# Altium schematic sheet Microcontroller.SchDoc
size Legal
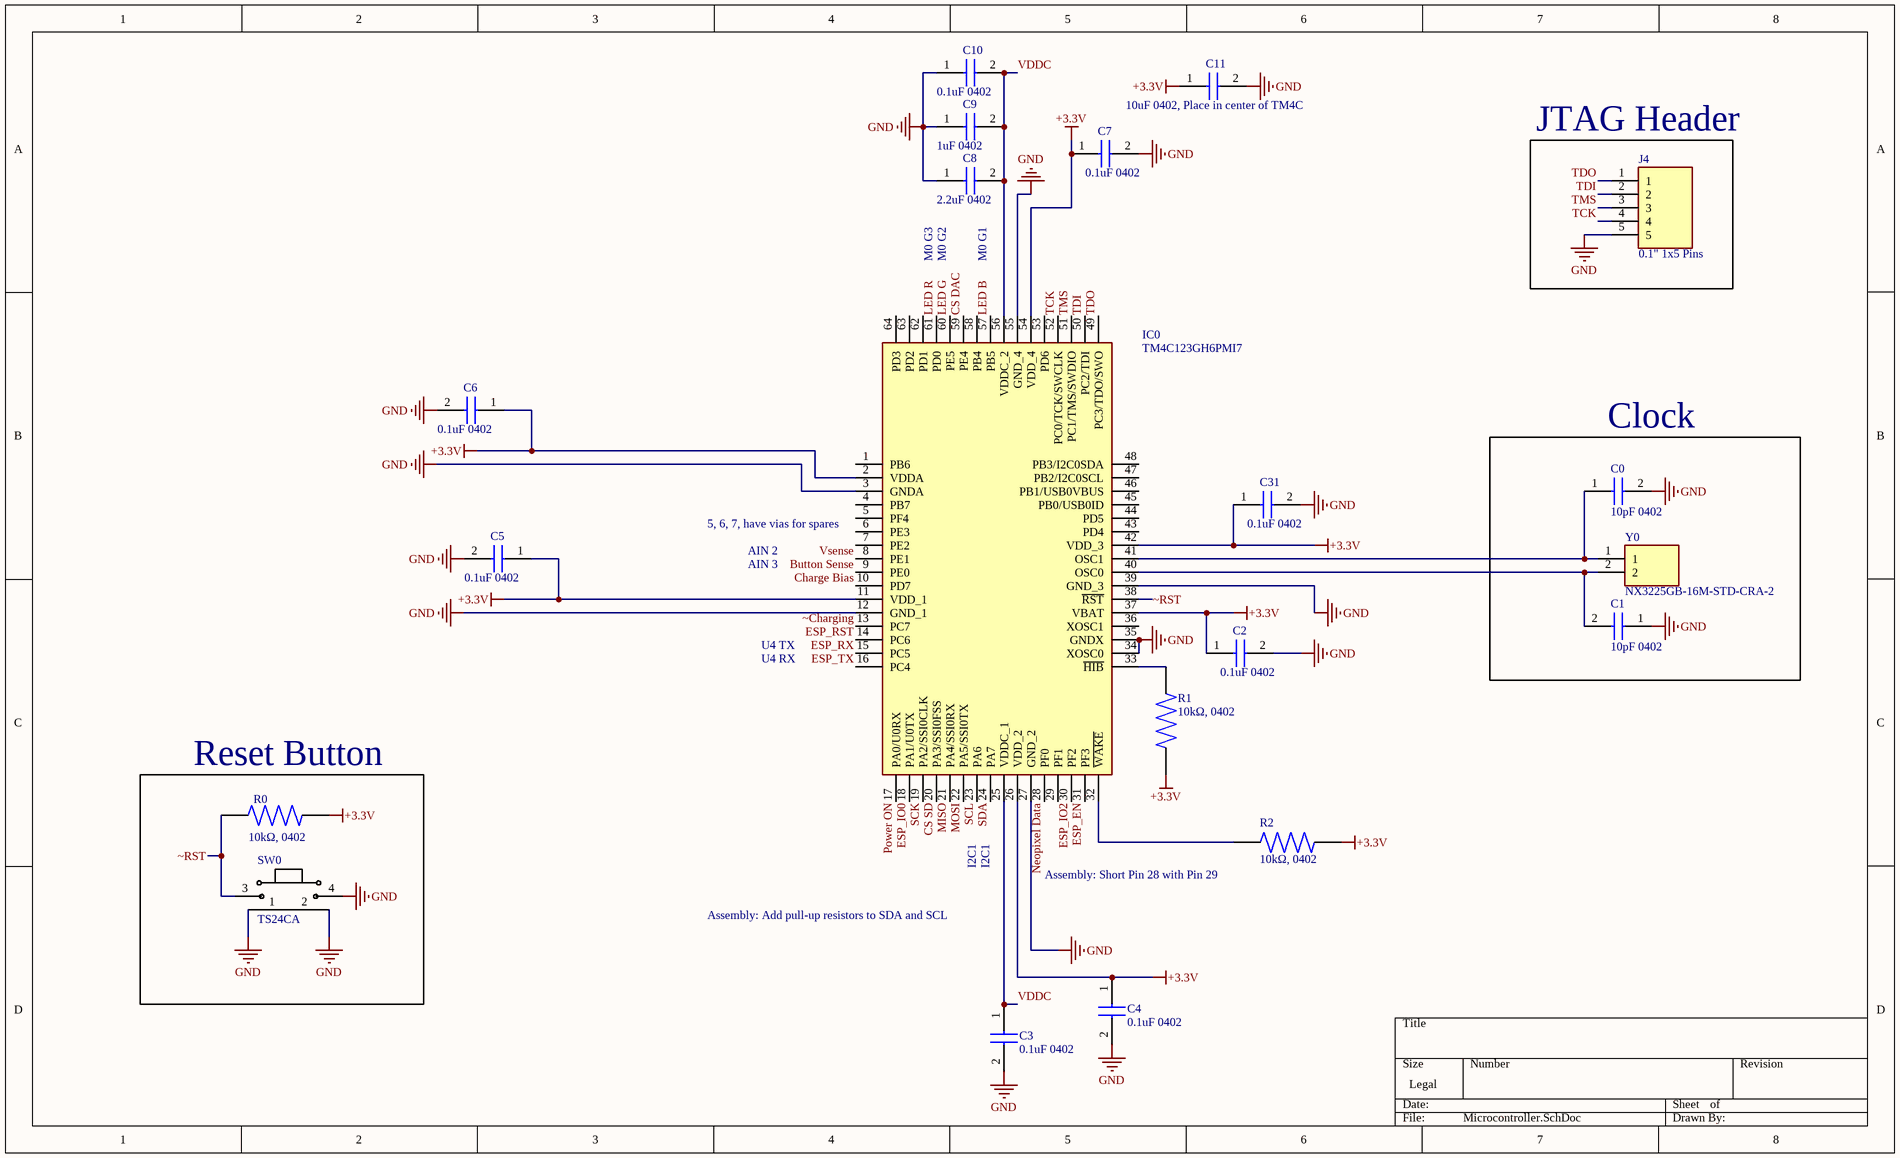
[diagram p0: Microcontroller.SchDoc]

## Parts
C0  10pF 0402  [CAPC1005X56N]
C1  10pF 0402  [CAPC1005X56N]
C2  0.1uF 0402  [CAPC1005X56N]
C3  0.1uF 0402  [CAPC1005X56N]
C4  0.1uF 0402  [CAPC1005X56N]
C5  0.1uF 0402  [CAPC1005X56N]
C6  0.1uF 0402  [CAPC1005X56N]
C7  0.1uF 0402  [CAPC1005X56N]
C8  2.2uF 0402  [CAPC1005X56N]
C9  1uF 0402  [CAPC1005X56N]
C10  0.1uF 0402  [CAPC1005X56N]
C11  10uF 0402, Place in center of TM4C  [CAPC1005X56N]
C31  0.1uF 0402  [CAPC1005X56N]
IC0  TM4C123GH6PMI7  [QFP50P1200X1200X160-64N]
J4  0.1" 1x5 Pins  [HDRV5W64P0X254_1X5_1270X254X610P]
R0  10kΩ, 0402  [0402]
R1  10kΩ, 0402  [0402]
R2  10kΩ, 0402  [0402]
SW0  TS24CA  [TS24CA]
Y0  NX3225GB-16M-STD-CRA-2  [NX3225GD-STD-CRA-3]

## Blocks framed on the sheet
JTAG Header: J4
Clock: C0 C1 Y0
Reset Button: R0 SW0

## Nets
+3.3V: C2.1 C4.1 C5.1 C6.1 C7.1 C11.1 C31.1 IC0.2(VDDA) IC0.11(VDD_1) IC0.26(VDD_2) IC0.37(VBAT) IC0.42(VDD_3) IC0.54(VDD_4) R0.2 R1.2 R2.2
GND: C0.2 C1.1 C2.2 C3.2 C4.2 C5.2 C6.2 C7.2 C8.1 C9.1 C10.1 C11.2 C31.2 IC0.3(GNDA) IC0.12(GND_1) IC0.27(GND_2) IC0.34(XOSC0) IC0.35(GNDX) IC0.39(GND_3) IC0.55(GND_4) J4.5 SW0.1 SW0.2 SW0.4
Button Sense: IC0.9(PE0)
Charge Bias: IC0.10(PD7)
CS DAC: IC0.59(PE4)
CS SD: IC0.20(PA3/SSI0FSS)
ESP_EN: IC0.31(PF3)
ESP_IO0: IC0.18(PA1/U0TX)
ESP_IO2: IC0.30(PF2)
ESP_RST: IC0.14(PC6)
ESP_RX: IC0.15(PC5)
ESP_TX: IC0.16(PC4)
LED B: IC0.57(PB5)
LED G: IC0.60(PE5)
LED R: IC0.61(PD0)
MISO: IC0.21(PA4/SSI0RX)
MOSI: IC0.22(PA5/SSI0TX)
Neopixel Data: IC0.28(PF0)
Power ON: IC0.17(PA0/U0RX)
SCK: IC0.19(PA2/SSI0CLK)
SCL: IC0.23(PA6)
SDA: IC0.24(PA7)
TCK: IC0.52(PC0/TCK/SWCLK) J4.4
TDI: IC0.50(PC2/TDI) J4.2
TDO: IC0.49(PC3/TDO/SWO) J4.1
TMS: IC0.51(PC1/TMS/SWDIO) J4.3
VDDC: C3.1 C8.2 C9.2 C10.2 IC0.25(VDDC_1) IC0.56(VDDC_2)
Vsense: IC0.8(PE1)
~Charging: IC0.13(PC7)
~RST: IC0.38(~{RST}) R0.1 SW0.3
NetC0_1: C0.1 IC0.41(OSC1) Y0.1
NetC1_2: C1.2 IC0.40(OSC0) Y0.2
NetIC0_32: IC0.32(~{WAKE}) R2.1
NetIC0_33: IC0.33(~{HIB}) R1.1

Not connected (* = marked no-connect by the designer): IC0 1(PB6) 4(PB7) 5(PF4) 6(PE3) 7(PE2) 29(PF1) 36(XOSC1) 43(PD4) 44(PD5) 45(PB0/USB0ID) 46(PB1/USB0VBUS) 47(PB2/I2C0SCL) 48(PB3/I2C0SDA) 53(PD6) 58(PB4) 62(PD1) 63(PD2) 64(PD3)

## Notes on the sheet
- M0 G3
- M0 G2
- (near C8) M0 G1
- (near IC0) 5, 6, 7, have vias for spares
- AIN 2
- AIN 3
- U4 TX
- U4 RX
- I2C1
- (near R2) Assembly: Short Pin 28 with Pin 29
- Assembly: Add pull-up resistors to SDA and SCL

## Library data of the parts
C0-C11 C31 = 04025A100BAT2A: Capacitor; Manufacturer_Name: AVX; Datasheet Link: http://www.mouser.com/catalog/supplier/library/pdf/AVXSurfaceMountCeramic.pdf; Height: 0.56mm; Manufacturer_Part_Number: 04025A100BAT2A; Arrow Part Number: 04025A100BAT2A; Arrow Price/Stock: https://www.arrow.com/en/products/04025a100bat2a/avx; Mouser Part Number: 581-04025A100B; Mouser Price/Stock: https://www.mouser.com/Search/Refine.aspx?Keyword=581-04025A100B
IC0 = TM4C123GH6PMI7: Integrated Circuit; Manufacturer_Name: Texas Instruments; Datasheet Link: http://www.ti.com/lit/gpn/tm4c123gh6pm; Height: 1.6mm; Manufacturer_Part_Number: TM4C123GH6PMI7; Arrow Part Number: TM4C123GH6PMI7; Arrow Price/Stock: https://www.arrow.com/en/products/tm4c123gh6pmi7/texas-instruments; Mouser Part Number: 595-TM4C123GH6PMI7; Mouser Price/Stock: https://www.mouser.co.uk/ProductDetail/Texas-Instruments/TM4C123GH6PMI7?qs=m%2F7bTylgptcEEuXHNU46tA%3D%3D
J4 = M20-9990546: Connector; Manufacturer_Name: Harwin; Datasheet Link: http://docs-emea.rs-online.com/webdocs/0da6/0900766b80da602d.pdf; Height: 6.1mm; Manufacturer_Part_Number: M20-9990546; Mouser Part Number: 855-M20-9990546; Mouser Price/Stock: https://www.mouser.co.uk/ProductDetail/Harwin/M20-9990546?qs=ulE8k0yEMYY8EKyDN9ic6A%3D%3D
R0-R2 = Resistor, 0402
Y0 = NX3225GB-16M-STD-CRA-2: Crystal or Oscillator; Manufacturer_Name: NDK; Datasheet Link: http://www.ndk.com/images/products/catalog/c_NX3225GB-STD-CRA-2_e.pdf; Manufacturer_Part_Number: NX3225GB-16M-STD-CRA-2; Mouser Part Number: 344-NX3225GB16MSTRA2; Mouser Price/Stock: https://www.mouser.co.uk/ProductDetail/NDK/NX3225GB-16M-STD-CRA-2?qs=w%2Fv1CP2dgqqz6Fo69dRGLg%3D%3D